# Altium project vdiv.PrjPcb
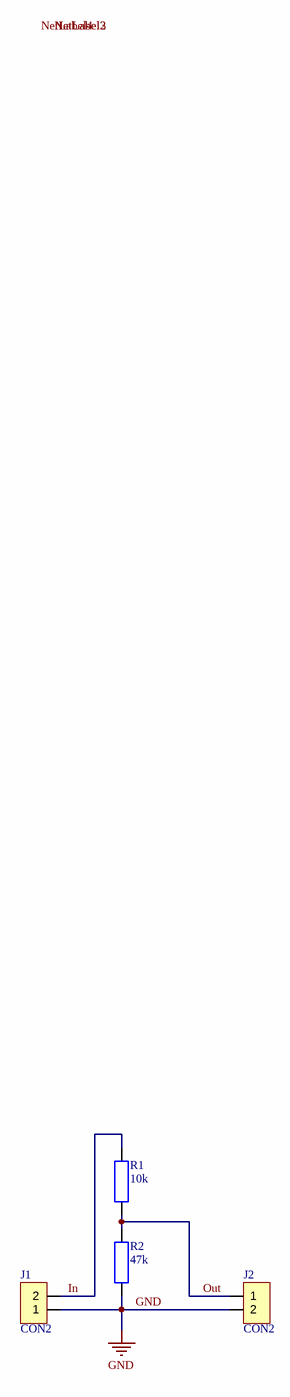
[diagram p0: vdiv.SchDoc]
1 sheet, 4 parts. Net scope: global (net labels, ports and power ports of the same name join across sheets).

## Sheet vdiv.SchDoc: Voltage Divider
size A3; DrawnBy: daniw; Organization: HSLU T&A; Address1: Abteilung Elektrotechnik; Address2: Technikumsstrasse 21; Address3: CH-6048 Horw; SheetNumber: 1; SheetTotal: 1; Projektname: vdiv

### Parts
J1  CON2  [POWER2]
J2  CON2  [POWER2]
R1  10k  [0805]
R2  47k  [0805]

### Nets
GND: J1.1 J2.2 R2.1
In: J1.2 R1.2
Out: J2.1 R1.1 R2.2

### Notes on the sheet
- Labels drawn without touching a wire or pin: NetLabel4
- Project:
- Drawn by:
- Size:
- Sheet
- A3
- Rev.:
- of
- Date:
- File:

### Library data of the parts
R1 R2 = R?: Normaler Widerstand